# EAGLE design SC_customized2 (EAGLE 9.5.2)
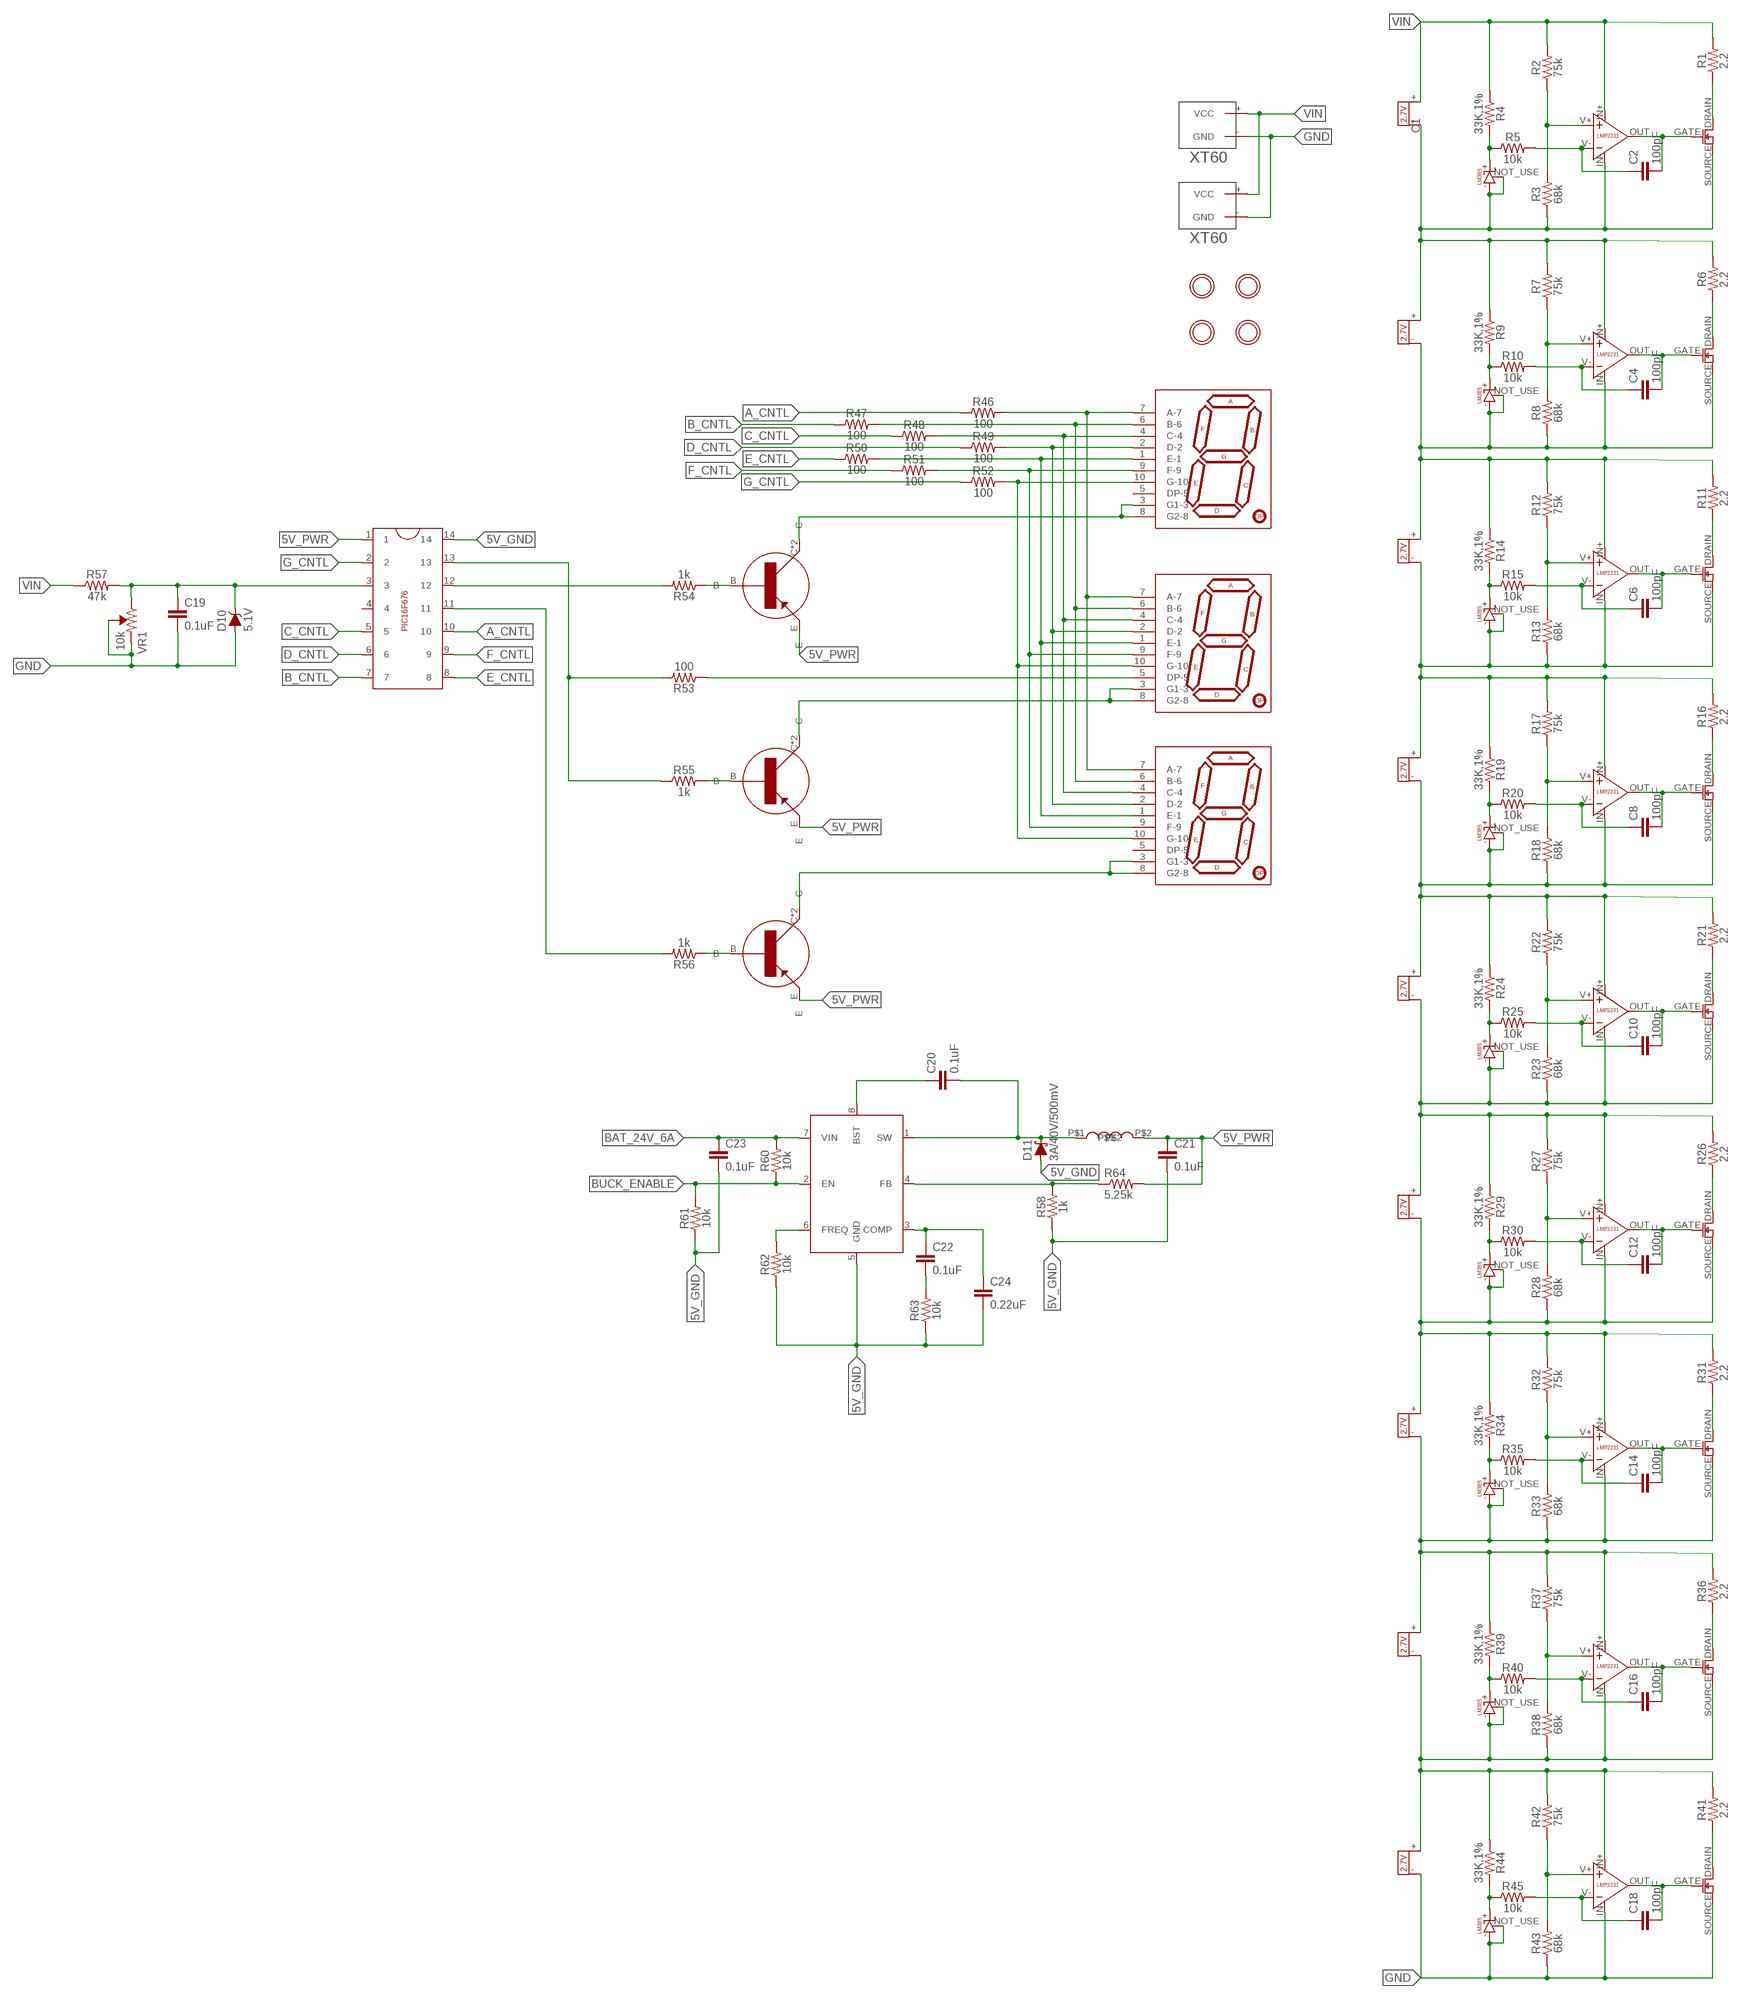
[diagram p0: schematic, sheet 1]

## Parts
3.3V_BUCK  SOIC8E  [SOIC127P600X170-9N]
C1  2.7V 60F  2.7V_60F  [2.7V_60F]
C2  100pF  100PF-0603-50V-5%  [0603]
C3  2.7V 60F  2.7V_60F  [2.7V_60F]
C4  100pF  100PF-0603-50V-5%  [0603]
C5  2.7V 60F  2.7V_60F  [2.7V_60F]
C6  100pF  100PF-0603-50V-5%  [0603]
C7  2.7V 60F  2.7V_60F  [2.7V_60F]
C8  100pF  100PF-0603-50V-5%  [0603]
C9  2.7V 60F  2.7V_60F  [2.7V_60F]
C10  100pF  100PF-0603-50V-5%  [0603]
C11  2.7V 60F  2.7V_60F  [2.7V_60F]
C12  100pF  100PF-0603-50V-5%  [0603]
C13  2.7V 60F  2.7V_60F  [2.7V_60F]
C14  100pF  100PF-0603-50V-5%  [0603]
C15  2.7V 60F  2.7V_60F  [2.7V_60F]
C16  100pF  100PF-0603-50V-5%  [0603]
C17  2.7V 60F  2.7V_60F  [2.7V_60F]
C18  100pF  100PF-0603-50V-5%  [0603]
C19  0.1uF  0.1UF-0603-25V-5%  [0603]
C20  0.1uF  0.1UF-0603-25V-(+80/-20%)  [0603]
C21  0.1uF  0.1UF-0603-25V-(+80/-20%)  [0603]
C22  0.1uF  0.1UF-0603-25V-(+80/-20%)  [0603]
C23  0.1uF  0.1UF-0603-25V-(+80/-20%)  [0603]
C24  0.22uF  0.22UF-0603-50V-(-20/+80%)  [0603]
D1  LM385  [LM385_SOT23]
D2  LM385  [LM385_SOT23]
D3  LM385  [LM385_SOT23]
D4  LM385  [LM385_SOT23]
D5  LM385  [LM385_SOT23]
D6  LM385  [LM385_SOT23]
D7  LM385  [LM385_SOT23]
D8  LM385  [LM385_SOT23]
D9  LM385  [LM385_SOT23]
D10  5.1V  DIODE-ZENER-MMSZ5232BS  [SOD-323]
D11  3A/40V/500mV  DIODE-SCHOTTKY-B340A  [SMA-DIODE]
LMP1  LMP2231  [LMP2231_SOT23_5]
LMP2  LMP2231  [LMP2231_SOT23_5]
LMP3  LMP2231  [LMP2231_SOT23_5]
LMP4  LMP2231  [LMP2231_SOT23_5]
LMP5  LMP2231  [LMP2231_SOT23_5]
LMP6  LMP2231  [LMP2231_SOT23_5]
LMP7  LMP2231  [LMP2231_SOT23_5]
LMP8  LMP2231  [LMP2231_SOT23_5]
LMP9  LMP2231  [LMP2231_SOT23_5]
MOS1  IRLML2502TRPBF_MOS  [IRLML2502TRPBF_SOT23]
MOS2  IRLML2502TRPBF_MOS  [IRLML2502TRPBF_SOT23]
MOS3  IRLML2502TRPBF_MOS  [IRLML2502TRPBF_SOT23]
MOS4  IRLML2502TRPBF_MOS  [IRLML2502TRPBF_SOT23]
MOS5  IRLML2502TRPBF_MOS  [IRLML2502TRPBF_SOT23]
MOS6  IRLML2502TRPBF_MOS  [IRLML2502TRPBF_SOT23]
MOS7  IRLML2502TRPBF_MOS  [IRLML2502TRPBF_SOT23]
MOS8  IRLML2502TRPBF_MOS  [IRLML2502TRPBF_SOT23]
MOS9  IRLML2502TRPBF_MOS  [IRLML2502TRPBF_SOT23]
PWR_IN  XT60  [XT60]
PWR_OUT  XT60  [XT60]
R1  2.2  0.05OHM-2512-3W-1%  [2512]
R2  75k  75KOHM-0603-1/10W-1%  [0603@1]
R3  68k  75KOHM-0603-1/10W-1%  [0603@1]
R4  33K,1%  1MOHM-0603-1/4W-5%  [0603@1]
R5  10k  10KOHM-0603-1/10W-1%  [0603]
R6  2.2  0.05OHM-2512-3W-1%  [2512]
R7  75k  75KOHM-0603-1/10W-1%  [0603@1]
R8  68k  75KOHM-0603-1/10W-1%  [0603@1]
R9  33K,1%  1MOHM-0603-1/4W-5%  [0603@1]
R10  10k  10KOHM-0603-1/10W-1%  [0603]
R11  2.2  0.05OHM-2512-3W-1%  [2512]
R12  75k  75KOHM-0603-1/10W-1%  [0603@1]
R13  68k  75KOHM-0603-1/10W-1%  [0603@1]
R14  33K,1%  1MOHM-0603-1/4W-5%  [0603@1]
R15  10k  10KOHM-0603-1/10W-1%  [0603]
R16  2.2  0.05OHM-2512-3W-1%  [2512]
R17  75k  75KOHM-0603-1/10W-1%  [0603@1]
R18  68k  75KOHM-0603-1/10W-1%  [0603@1]
R19  33K,1%  1MOHM-0603-1/4W-5%  [0603@1]
R20  10k  10KOHM-0603-1/10W-1%  [0603]
R21  2.2  0.05OHM-2512-3W-1%  [2512]
R22  75k  75KOHM-0603-1/10W-1%  [0603@1]
R23  68k  75KOHM-0603-1/10W-1%  [0603@1]
R24  33K,1%  1MOHM-0603-1/4W-5%  [0603@1]
R25  10k  10KOHM-0603-1/10W-1%  [0603]
R26  2.2  0.05OHM-2512-3W-1%  [2512]
R27  75k  75KOHM-0603-1/10W-1%  [0603@1]
R28  68k  75KOHM-0603-1/10W-1%  [0603@1]
R29  33K,1%  1MOHM-0603-1/4W-5%  [0603@1]
R30  10k  10KOHM-0603-1/10W-1%  [0603]
R31  2.2  0.05OHM-2512-3W-1%  [2512]
R32  75k  75KOHM-0603-1/10W-1%  [0603@1]
R33  68k  75KOHM-0603-1/10W-1%  [0603@1]
R34  33K,1%  1MOHM-0603-1/4W-5%  [0603@1]
R35  10k  10KOHM-0603-1/10W-1%  [0603]
R36  2.2  0.05OHM-2512-3W-1%  [2512]
R37  75k  75KOHM-0603-1/10W-1%  [0603@1]
R38  68k  75KOHM-0603-1/10W-1%  [0603@1]
R39  33K,1%  1MOHM-0603-1/4W-5%  [0603@1]
R40  10k  10KOHM-0603-1/10W-1%  [0603]
R41  2.2  0.05OHM-2512-3W-1%  [2512]
R42  75k  75KOHM-0603-1/10W-1%  [0603@1]
R43  68k  75KOHM-0603-1/10W-1%  [0603@1]
R44  33K,1%  1MOHM-0603-1/4W-5%  [0603@1]
R45  10k  10KOHM-0603-1/10W-1%  [0603]
R46  100  100OHM-0603-1/4W-5%  [0603]
R47  100  100OHM-0603-1/4W-5%  [0603]
R48  100  100OHM-0603-1/4W-5%  [0603]
R49  100  100OHM-0603-1/4W-5%  [0603]
R50  100  100OHM-0603-1/4W-5%  [0603]
R51  100  100OHM-0603-1/4W-5%  [0603]
R52  100  100OHM-0603-1/4W-5%  [0603]
R53  100  100OHM-0603-1/4W-5%  [0603]
R54  1k  1KOHM-0603-1/10W-1%  [0603]
R55  1k  1KOHM-0603-1/10W-1%  [0603]
R56  1k  1KOHM-0603-1/10W-1%  [0603]
R57  47k  47KOHM-0603-1/10W-1%  [0603]
R58  1k  1KOHM-0603-1/10W-1%  [0603]
R60  10k  10KOHM-0603-1/10W-1%  [0603]
R61  10k  10KOHM-0603-1/10W-1%  [0603]
R62  10k  10KOHM-0603-1/10W-1%  [0603]
R63  10k  10KOHM-0603-1/10W-1%  [0603]
R64  5.25k  CRCW08050000Z0EA  [RES_0805]
U$1  MOUNTINGHOLE2.5  [MOUNTINGHOLE_2.5_PLATED]
U$2  MOUNTINGHOLE2.5  [MOUNTINGHOLE_2.5_PLATED]
U$3  PZT3906  [SOT_223]
U$4  MOUNTINGHOLE2.5  [MOUNTINGHOLE_2.5_PLATED]
U$5  PZT3906  [SOT_223]
U$6  PZT3906  [SOT_223]
U$7  DSM7T  [7-SEGMENT_SMD]
U$8  DSM7T  [7-SEGMENT_SMD]
U$9  DSM7T  [7-SEGMENT_SMD]
U$10  PIC16F676  [PIC16F676]
U$11  4.7UH_INDUCTOR  [4.7UH_INDUCTOR]
U$49  MOUNTINGHOLE2.5  [MOUNTINGHOLE_2.5_PLATED]
VR1  10k  TRIMPOT-SMD-3MM-OPEN-1/10W-25%  [TRIMPOT-SMD-TC33X]

## Nets
5V_GND: 3.3V_BUCK.5(GND) C21.2 C23.2 C24.2 D11.A R58.1 R61.1 R62.1 R63.1 U$10.14
5V_PWR: C21.1 R64.2 U$3.E U$5.E U$6.E U$10.1 U$11.P$2
A_CNTL: R46.1 U$10.10
B_CNTL: R47.1 U$10.7
BAT_24V_6A: 3.3V_BUCK.7(VIN) C23.1 R60.2
BUCK_ENABLE: 3.3V_BUCK.2(EN) R60.1 R61.2
C_CNTL: R48.1 U$10.5
D_CNTL: R49.1 U$10.6
E_CNTL: R50.1 U$10.8
F_CNTL: R51.1 U$10.9
G_CNTL: R52.1 U$10.2
GND: C17.- C19.2 D9.- D9.NOT_USE D10.A LMP9.IN- MOS9.SOURCE PWR_IN.-(GND) PWR_OUT.-(GND) R43.1 VR1.2(WIPER) VR1.3(CCW)
N$1: R46.2 U$7.7(A-7) U$8.7(A-7) U$9.7(A-7)
N$2: MOS1.DRAIN R1.P$1
N$3: C2.2 LMP1.OUT MOS1.GATE
N$4: C1.- C3.+ D1.- D1.NOT_USE LMP1.IN- LMP2.IN+ MOS1.SOURCE R3.1 R6.P$2 R7.2 R9.1
N$5: LMP1.V+ R2.1 R3.2
N$6: C2.1 LMP1.V- R5.2
N$7: D1.+ R4.2 R5.1
N$8: C19.1 D10.C R57.2 U$10.3 VR1.1(CW)
N$9: MOS2.DRAIN R6.P$1
N$10: C4.2 LMP2.OUT MOS2.GATE
N$11: C3.- C5.+ D2.- D2.NOT_USE LMP2.IN- LMP3.IN+ MOS2.SOURCE R8.1 R11.P$2 R12.2 R14.1
N$12: LMP2.V+ R7.1 R8.2
N$13: C4.1 LMP2.V- R10.2
N$14: D2.+ R9.2 R10.1
N$15: R47.2 U$7.6(B-6) U$8.6(B-6) U$9.6(B-6)
N$16: MOS3.DRAIN R11.P$1
N$17: C6.2 LMP3.OUT MOS3.GATE
N$18: C5.- C7.+ D3.- D3.NOT_USE LMP3.IN- LMP4.IN+ MOS3.SOURCE R13.1 R16.P$2 R17.2 R19.1
N$19: LMP3.V+ R12.1 R13.2
N$20: C6.1 LMP3.V- R15.2
N$21: D3.+ R14.2 R15.1
N$22: R56.2 U$10.11
N$23: MOS4.DRAIN R16.P$1
N$24: C8.2 LMP4.OUT MOS4.GATE
N$25: C7.- C9.+ D4.- D4.NOT_USE LMP4.IN- LMP5.IN+ MOS4.SOURCE R18.1 R21.P$2 R22.2 R24.1
N$26: LMP4.V+ R17.1 R18.2
N$27: C8.1 LMP4.V- R20.2
N$28: D4.+ R19.2 R20.1
N$29: R48.2 U$7.4(C-4) U$8.4(C-4) U$9.4(C-4)
N$30: MOS5.DRAIN R21.P$1
N$31: C10.2 LMP5.OUT MOS5.GATE
N$32: C9.- C11.+ D5.- D5.NOT_USE LMP5.IN- LMP6.IN+ MOS5.SOURCE R23.1 R26.P$2 R27.2 R29.1
N$33: LMP5.V+ R22.1 R23.2
N$34: C10.1 LMP5.V- R25.2
N$35: D5.+ R24.2 R25.1
N$36: R49.2 U$7.2(D-2) U$8.2(D-2) U$9.2(D-2)
N$37: MOS6.DRAIN R26.P$1
N$38: C12.2 LMP6.OUT MOS6.GATE
N$39: C11.- C13.+ D6.- D6.NOT_USE LMP6.IN- LMP7.IN+ MOS6.SOURCE R28.1 R31.P$2 R32.2 R34.1
N$40: LMP6.V+ R27.1 R28.2
N$41: C12.1 LMP6.V- R30.2
N$42: D6.+ R29.2 R30.1
N$43: R50.2 U$7.1(E-1) U$8.1(E-1) U$9.1(E-1)
N$44: MOS7.DRAIN R31.P$1
N$45: C14.2 LMP7.OUT MOS7.GATE
N$46: C13.- C15.+ D7.- D7.NOT_USE LMP7.IN- LMP8.IN+ MOS7.SOURCE R33.1 R36.P$2 R37.2 R39.1
N$47: LMP7.V+ R32.1 R33.2
N$48: C14.1 LMP7.V- R35.2
N$49: D7.+ R34.2 R35.1
N$50: R56.1 U$6.B
N$51: MOS8.DRAIN R36.P$1
N$52: C16.2 LMP8.OUT MOS8.GATE
N$53: C15.- C17.+ D8.- D8.NOT_USE LMP8.IN- LMP9.IN+ MOS8.SOURCE R38.1 R41.P$2 R42.2 R44.1
N$54: LMP8.V+ R37.1 R38.2
N$55: C16.1 LMP8.V- R40.2
N$56: D8.+ R39.2 R40.1
N$57: U$3.C U$3.C2(C) U$7.3(G1-3) U$7.8(G2-8)
N$58: MOS9.DRAIN R41.P$1
N$59: C18.2 LMP9.OUT MOS9.GATE
N$60: U$5.C U$5.C2(C) U$9.3(G1-3) U$9.8(G2-8)
N$61: LMP9.V+ R42.1 R43.2
N$62: C18.1 LMP9.V- R45.2
N$63: D9.+ R44.2 R45.1
N$64: U$6.C U$6.C2(C) U$8.3(G1-3) U$8.8(G2-8)
N$65: R55.2 U$5.B
N$66: R54.1 U$3.B
N$67: R53.1 U$9.5(DP-5)
N$68: R53.2 R55.1 U$10.13
N$69: R54.2 U$10.12
N$70: R51.2 U$7.9(F-9) U$8.9(F-9) U$9.9(F-9)
N$71: R52.2 U$7.10(G-10) U$8.10(G-10) U$9.10(G-10)
N$72: 3.3V_BUCK.1(SW) C20.2 D11.C U$11.P$1
N$73: 3.3V_BUCK.4(FB) R58.2 R64.1
N$74: 3.3V_BUCK.8(BST) C20.1
N$75: 3.3V_BUCK.6(FREQ) R62.2
N$76: 3.3V_BUCK.3(COMP) C22.1 C24.1
N$77: C22.2 R63.2
VIN: C1.+ LMP1.IN+ PWR_IN.+(VCC) PWR_OUT.+(VCC) R1.P$2 R2.2 R4.1 R57.1
Unconnected: U$7.5(DP-5) U$8.5(DP-5) U$10.4

## Library data of the parts
3.3V_BUCK = SOIC127P600X170-9N:SOIC8E
C1 C3 C5 C7 C9 C11 C13 C15 C17 = personal Made:2.7V_60F
C2 C4 C6 C8 C10 C12 C14 C16 C18 = SparkFun-Capacitors:100PF: 100pF/0.1nF ceramic capacitors A capacitor is a passive two-terminal electrical component used to store electrical energy temporarily in an electric field.; PROD_ID: CAP-07883
C19 = SparkFun-Capacitors:0.1UF: 0.1µF ceramic capacitors A capacitor is a passive two-terminal electrical component used to store electrical energy temporarily in an electric field.; PROD_ID: CAP-08604
C20-C23 = SparkFun-Capacitors:0.1UF: 0.1µF ceramic capacitors A capacitor is a passive two-terminal electrical component used to store electrical energy temporarily in an electric field.; PROD_ID: CAP-00810
C24 = SparkFun-Capacitors:0.22UF: 0.22µF ceramic capacitors A capacitor is a passive two-terminal electrical component used to store electrical energy temporarily in an electric field.; PROD_ID: CAP-09885
D1-D9 = personal Made:LM385
D10 = SparkFun-DiscreteSemi:DIODE-ZENER: Zener Diode A Zener diode allows current to flow from its anode to its cathode like a normal semiconductor diode, but it also permits current to flow in the reverse direction when its "Zener voltage" is reached. - WIkipedia; PROD_ID: DIO-12442; VALUE: 5.6V
D11 = SparkFun-DiscreteSemi:DIODE-SCHOTTKY: Schottky diode A Schottky diode is a semiconductor diode which has a low forward voltage drop and a very fast switching action.; PROD_ID: DIO-09886
LMP1-LMP9 = personal Made:LMP2231
MOS1-MOS9 = personal Made:IRLML2502TRPBF_MOS
PWR_IN PWR_OUT = XT60:XT60: XT60
R1 R6 R11 R16 R21 R26 R31 R36 R41 = SparkFun-Resistors:0.05OHM: 0.05Ω resistor A resistor is a passive two-terminal electrical component that implements electrical resistance as a circuit element. Resistors act to reduce current flow, and, at the same time, act to lower voltage levels within circuits. - Wikipedia; PROD_ID: RES-13771; VALUE: 0.05
R2 R3 R7 R8 R12 R13 R17 R18 R22 R23 R27 R28 R32 R33 R37 R38 R42 R43 = SparkFun-Resistors:75KOHM: 75Ω resistor A resistor is a passive two-terminal electrical component that implements electrical resistance as a circuit element. Resistors act to reduce current flow, and, at the same time, act to lower voltage levels within circuits. - Wikipedia; PROD_ID: RES-09737; VALUE: 75
R4 R9 R14 R19 R24 R29 R34 R39 R44 = SparkFun-Resistors:1MOHM: 1MΩ resistor A resistor is a passive two-terminal electrical component that implements electrical resistance as a circuit element. Resistors act to reduce current flow, and, at the same time, act to lower voltage levels within circuits. - Wikipedia; PROD_ID: RES-07868; VALUE: 1M
R5 R10 R15 R20 R25 R30 R35 R40 R45 R60-R63 = SparkFun-Resistors:10KOHM: 10kΩ resistor A resistor is a passive two-terminal electrical component that implements electrical resistance as a circuit element. Resistors act to reduce current flow, and, at the same time, act to lower voltage levels within circuits. - Wikipedia; PROD_ID: RES-00824
R46-R53 = SparkFun-Resistors:100OHM: 100Ω resistor A resistor is a passive two-terminal electrical component that implements electrical resistance as a circuit element. Resistors act to reduce current flow, and, at the same time, act to lower voltage levels within circuits. - Wikipedia; PROD_ID: RES-12438
R54-R56 R58 = SparkFun-Resistors:1KOHM: 1kΩ resistor A resistor is a passive two-terminal electrical component that implements electrical resistance as a circuit element. Resistors act to reduce current flow, and, at the same time, act to lower voltage levels within circuits. - Wikipedia; PROD_ID: RES-07856
R57 = SparkFun-Resistors:47KOHM: 47kΩ resistor A resistor is a passive two-terminal electrical component that implements electrical resistance as a circuit element. Resistors act to reduce current flow, and, at the same time, act to lower voltage levels within circuits. - Wikipedia; PROD_ID: RES-07871
R64 = Resistor_Capacitor:CRCW08050000Z0EA: RES SMD 0 OHM JUMPER 1/8W 0805 Manufacturer's datasheet <http://www.vishay.com/docs/20035/dcrcwe3.pdf>; CREATED_BY: PCBLayout.com; DIGIKEY_PART_NUMBER: 541-0.0ATR-ND; MANUFACTURER: Vishay Dale; MPN: CRCW08050000Z0EA; PACKAGE: SMD 0805
U$1 U$2 U$4 U$49 = microbuilder:MOUNTINGHOLE: Mounting Hole For #2 screws (0.086"/2.18mm width, 0.094"/2.4mm hole) use 2.5mm; BOM: EXCLUDE
U$3 U$5 U$6 = Custom:PZT3906
U$7-U$9 = Custom:DSM7T
U$10 = Custom:PIC16F676
U$11 = Custom:4.7UH_INDUCTOR
VR1 = SparkFun-Resistors:TRIMPOT: Trimming Potentiometer (Trimpot) Three-terminal potentiometers, with an adjustable wiper and two adjustable resistors. A pot can be used to create a configurable voltage divider, or as a variable resistor. "Trimpots" are a subset of potentiometers, usually intended for "set-and-forget" applications. They're often more delicate than standard potentiometers - rated for fewer turns. Variants PTH-KNOB - PTH Trimpot w/ finger-adjustable knob Trimpot 10K with Knob <https://www.sparkfun.com/products/9806> (COM-09806) Datasheet <http://www.sparkfun.com/datasheets/Components/General/TSR-3386.pdf> SMD-3MM-CLOSED-FRAME - SMD 3mm Square Closed-Frame Trimpot Used on e.g. EasyDriver - Stepper Motor Driver <https://www.sparkfun.com/products/12779> Datasheet <http://www.bitechnologies.com/pdfs/22.pdf> (22AR10KTR) SMD-5MM - SMD 5mm Square Closed-Frame Trimpot Used on e.g. IOIO-OTG - V2.2 <https://www.sparkfun.com/products/13613> Datasheet <http://www.vishay.com/docs/51008/ts53.pdf> (TS53YL502MR10) SMD-3MM-1/10W-25% - 3mm Square Open-Frame Trimpot Used on e.g. SparkFun Shapeoko <https://www.sparkfun.com/products/13899> Datasheet <http://www.bourns.com/docs/Product-Datasheets/TC33.pdf> (TC33X-2-103E); PROD_ID: RES-12428

## Board
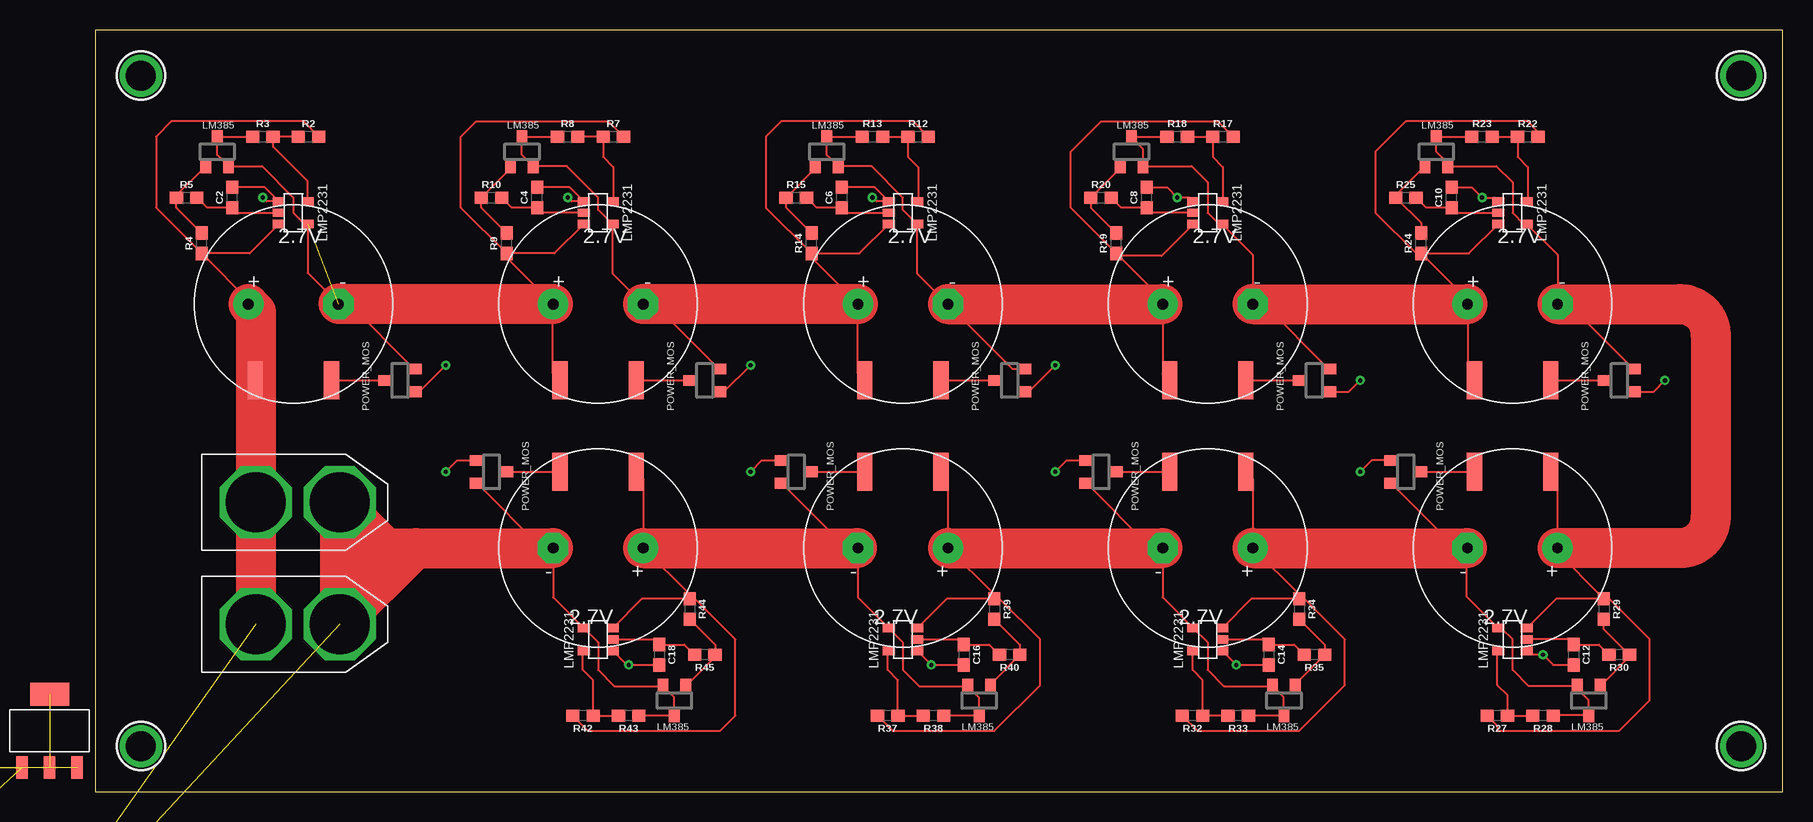
[diagram p1: board, top side]
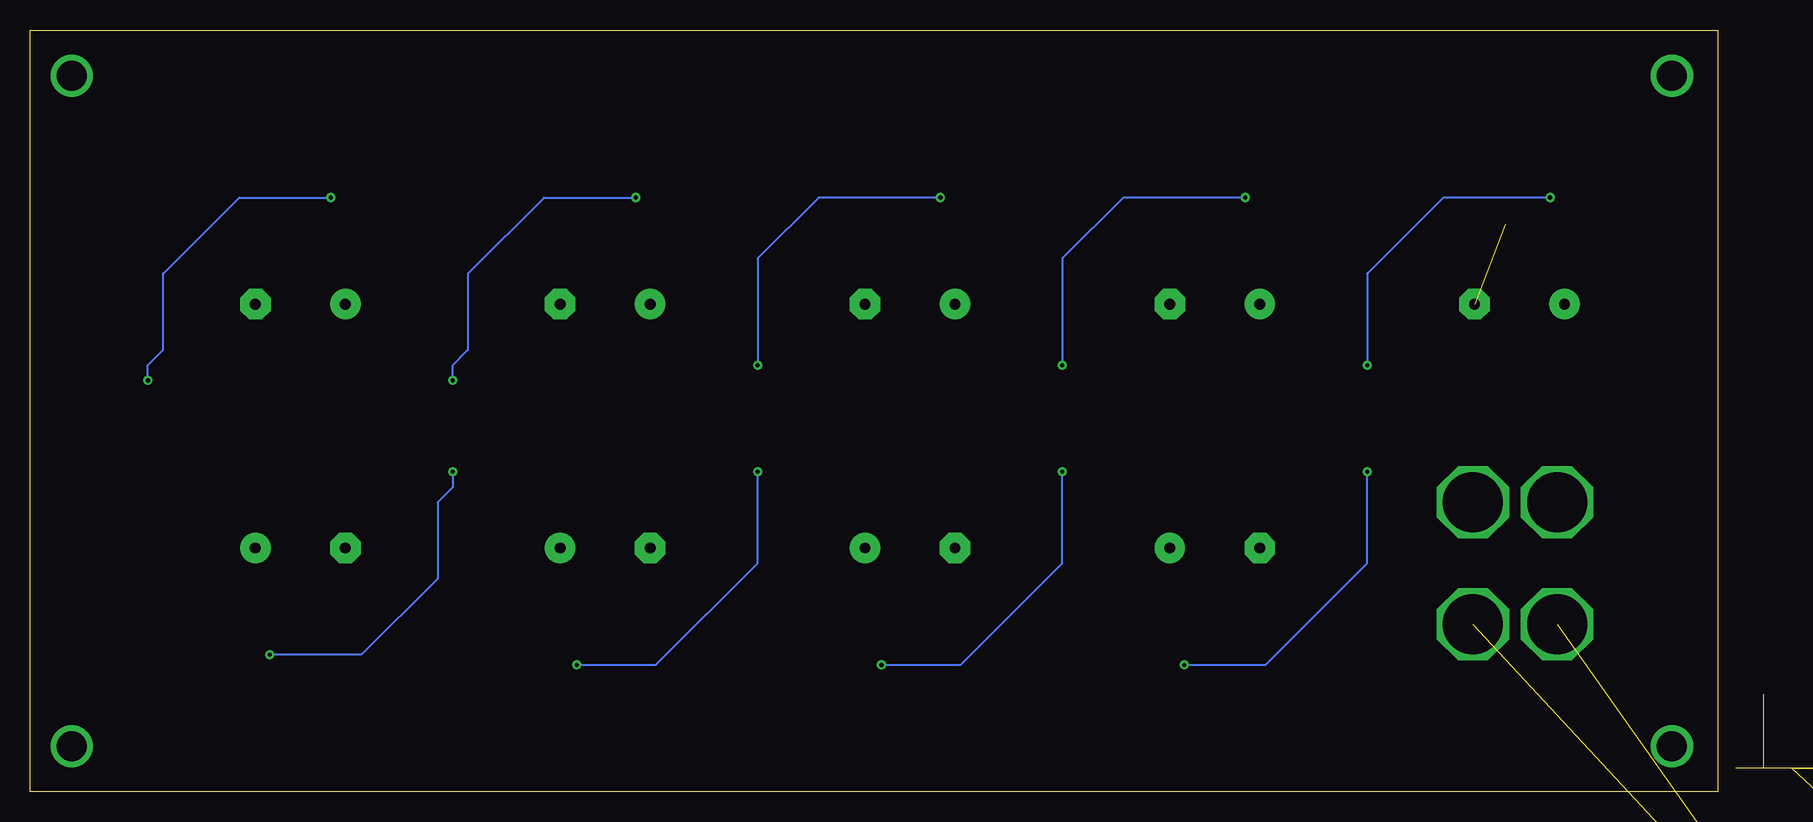
[diagram p2: board, bottom side, seen from below]

Size 140.64 x 63.49 mm. Coordinates in mm from the lower left corner, seen from the top.
Outline: 0,63.49 0,0 140.64,0 140.64,63.49 0,63.49
Copper layers (1*16): Top 0.035mm / dielectric 1.5mm / Bottom 0.035mm
Design rules "default": minimum track width 6mil, minimum drill 0.35mm, track to track 6mil, track to pad 6mil, pad to pad 6mil, via to via 6mil, smd to smd 6mil, copper to edge 40mil, drill to drill 6mil, minimum pad ring 10mil, minimum via ring 8mil, stop-mask expansion 4mil, vias tented up to drill 0mil, thermal gap 10mil

### Footprints (pad centres in the part's own frame; a part is rotated, then mirrored left to right if it is on the bottom)
SOIC127P600X170-9N = smd 1.97 x 0.6: 1 -2.475,1.905; 2 -2.475,0.635; 3 -2.475,-0.635; 4 -2.475,-1.905; 5 2.475,-1.905; 6 2.475,-0.635; 7 2.475,0.635; 8 2.475,1.905 | smd 2.4 x 3.1: 9 0,0 | drill 0.3 pad 0.4: V1 -0.65,1.3; V2 0.65,1.3; V3 -0.65,0; V4 0.65,0; V5 -0.65,-1.3; V6 0.65,-1.3
2.7V_60F = drill 0.9 pad 2.54: + -3.75,0 | drill 0.9 pad 2.54 octagon: - 3.75,0
0603 = smd 1.1 x 1: 1 -0.85,0; 2 0.85,0
LM385_SOT23 = smd 0.9 x 1.2: + -0.95,-1.2; - 0.95,-1.2; NOT_USE 0,1.2
SOD-323 = smd 0.63 x 0.83: A 1.15,0; C -1.15,0
SMA-DIODE = smd 1.27 x 1.47: A -2.15,0; C 2.15,0
LMP2231_SOT23_5 = smd 0.7 x 1: IN+ 0.95,-1.2; IN- 0.95,1.2; OUT -0.95,-1.2; V+ -0.95,1.2; V- 0,-1.2
IRLML2502TRPBF_SOT23 = smd 0.9 x 1.2: DRAIN 0,1.2; GATE -0.95,-1.2; SOURCE 0.95,-1.2
XT60 = drill 5 octagon: + 4.5,0; - 11.5,0
2512 = smd 1.27 x 3.175: P$1 -3.175,0; P$2 3.175,0
0603@1 = smd 1.1 x 1: 1 -0.85,0; 2 0.85,0
RES_0805 = smd 0.87 x 1.42: 1 -0.975,0; 2 0.975,0
MOUNTINGHOLE_2.5_PLATED = drill 2.5 pad 3.2: P$1 0,0
SOT_223 = smd 0.95 x 1.9: B -2.3,-3.05; C 0,-3.05; E 2.3,-3.05 | smd 3.25 x 1.9: C2 0,3.05
7-SEGMENT_SMD = smd 1 x 2: 1 -3,-6; 2 -1.5,-6; 3 0,-6; 4 1.5,-6; 5 3,-6; 6 3,6; 7 1.5,6; 8 0,6; 9 -1.5,6; 10 -3,6
PIC16F676 = smd 0.6 x 1.5: 1 -3.81,-2.7; 2 -2.54,-2.7; 3 -1.27,-2.7; 4 0,-2.7; 5 1.27,-2.7; 6 2.54,-2.7; 7 3.81,-2.7; 8 3.81,2.7; 9 2.54,2.7; 10 1.27,2.7; 11 0,2.7; 12 -1.27,2.7; 13 -2.54,2.7; 14 -3.81,2.7
4.7UH_INDUCTOR = smd 2.4 x 5.1: P$1 -2.35,0; P$2 2.35,0
TRIMPOT-SMD-TC33X = smd 1.2 x 1.2: 1 -1,-1.825; 3 1,-1.825 | smd 1.5 x 1.6: 2 0,1.5

### Placement (x,y rotation side)
3.3V_BUCK  -40.64,-73.66 0 top  (outside the outline)
C1  16.51,40.64 0 top
C2  11.43,49.53 90 top
C3  41.91,40.64 0 top
C4  36.83,49.53 90 top
C5  67.31,40.64 0 top
C6  62.23,49.53 90 top
C7  92.71,40.64 0 top
C8  87.63,49.53 90 top
C9  118.11,40.64 0 top
C10  113.03,49.53 90 top
C11  118.11,20.32 180 top
C12  123.19,11.43 270 top
C13  92.71,20.32 180 top
C14  97.79,11.43 270 top
C15  67.31,20.32 180 top
C16  72.39,11.43 270 top
C17  41.91,20.32 180 top
C18  46.99,11.43 270 top
C19  -43.18,-57.15 0 top  (outside the outline)
C20  -36.83,-80.01 0 top  (outside the outline)
C21  -33.02,-80.01 0 top  (outside the outline)
C22  -29.21,-80.01 0 top  (outside the outline)
C23  -43.18,-86.36 0 top  (outside the outline)
C24  -39.37,-86.36 0 top  (outside the outline)
D1  10.16,53.34 0 top
D2  35.56,53.34 0 top
D3  60.96,53.34 0 top
D4  86.36,53.34 0 top
D5  111.76,53.34 0 top
D6  124.46,7.62 180 top
D7  99.06,7.62 180 top
D8  73.66,7.62 180 top
D9  48.26,7.62 180 top
D10  -43.18,-53.34 0 top  (outside the outline)
D11  -41.91,-81.28 0 top  (outside the outline)
LMP1  16.51,48.26 270 top
LMP2  41.91,48.26 270 top
LMP3  67.31,48.26 270 top
LMP4  92.71,48.26 270 top
LMP5  118.11,48.26 270 top
LMP6  118.11,12.7 90 top
LMP7  92.71,12.7 90 top
LMP8  67.31,12.7 90 top
LMP9  41.91,12.7 90 top
MOS1  25.4,34.29 90 top
MOS2  50.8,34.29 90 top
MOS3  76.2,34.29 90 top
MOS4  101.6,34.29 90 top
MOS5  127,34.29 90 top
MOS6  109.22,26.67 270 top
MOS7  83.82,26.67 270 top
MOS8  58.42,26.67 270 top
MOS9  33.02,26.67 270 top
PWR_IN  8.89,24.13 0 top
PWR_OUT  8.89,13.97 0 top
R1  16.51,34.29 180 top
R2  17.78,54.61 0 top
R3  13.97,54.61 0 top
R4  8.89,45.72 90 top
R5  7.62,49.53 0 top
R6  41.91,34.29 180 top
R7  43.18,54.61 0 top
R8  39.37,54.61 0 top
R9  34.29,45.72 90 top
R10  33.02,49.53 0 top
R11  67.31,34.29 180 top
R12  68.58,54.61 0 top
R13  64.77,54.61 0 top
R14  59.69,45.72 90 top
R15  58.42,49.53 0 top
R16  92.71,34.29 180 top
R17  93.98,54.61 0 top
R18  90.17,54.61 0 top
R19  85.09,45.72 90 top
R20  83.82,49.53 0 top
R21  118.11,34.29 180 top
R22  119.38,54.61 0 top
R23  115.57,54.61 0 top
R24  110.49,45.72 90 top
R25  109.22,49.53 0 top
R26  118.11,26.67 0 top
R27  116.84,6.35 180 top
R28  120.65,6.35 180 top
R29  125.73,15.24 270 top
R30  127,11.43 180 top
R31  92.71,26.67 0 top
R32  91.44,6.35 180 top
R33  95.25,6.35 180 top
R34  100.33,15.24 270 top
R35  101.6,11.43 180 top
R36  67.31,26.67 0 top
R37  66.04,6.35 180 top
R38  69.85,6.35 180 top
R39  74.93,15.24 270 top
R40  76.2,11.43 180 top
R41  41.91,26.67 0 top
R42  40.64,6.35 180 top
R43  44.45,6.35 180 top
R44  49.53,15.24 270 top
R45  50.8,11.43 180 top
R46  -43.18,-2.54 0 top  (outside the outline)
R47  -43.18,-6.35 0 top  (outside the outline)
R48  -43.18,-10.16 0 top  (outside the outline)
R49  -43.18,-13.97 0 top  (outside the outline)
R50  -43.18,-17.78 0 top  (outside the outline)
R51  -43.18,-21.59 0 top  (outside the outline)
R52  -43.18,-25.4 0 top  (outside the outline)
R53  -43.18,-29.21 0 top  (outside the outline)
R54  -43.18,-33.02 0 top  (outside the outline)
R55  -43.18,-36.83 0 top  (outside the outline)
R56  -43.18,-40.64 0 top  (outside the outline)
R57  -43.18,-67.31 0 top  (outside the outline)
R58  -35.56,-86.36 0 top  (outside the outline)
R60  -27.94,-86.36 0 top  (outside the outline)
R61  -43.18,-90.17 0 top  (outside the outline)
R62  -39.37,-90.17 0 top  (outside the outline)
R63  -35.56,-90.17 0 top  (outside the outline)
R64  -41.91,-95.25 0 top  (outside the outline)
U$1  137.16,59.69 0 top
U$2  137.16,3.81 0 top
U$3  -3.81,5.08 0 top
U$4  3.81,59.69 0 top
U$5  -11.43,5.08 0 top  (outside the outline)
U$6  -19.05,5.08 0 top  (outside the outline)
U$7  -26.67,7.62 0 top  (outside the outline)
U$8  -34.29,7.62 0 top  (outside the outline)
U$9  -41.91,7.62 0 top  (outside the outline)
U$10  -40.64,-46.99 0 top  (outside the outline)
U$11  -30.48,-72.39 0 top  (outside the outline)
U$49  3.81,3.81 0 top
VR1  -41.91,-62.23 0 top  (outside the outline)

### Tracks (layer width: path | path; a pad name or v marks a point on that pad's centre or on a via)
5V_GND  (9 unrouted)
5V_PWR  (6 unrouted)
A_CNTL  (1 unrouted)
B_CNTL  (1 unrouted)
BAT_24V_6A  (2 unrouted)
BUCK_ENABLE  (2 unrouted)
C_CNTL  (1 unrouted)
D_CNTL  (1 unrouted)
E_CNTL  (1 unrouted)
F_CNTL  (1 unrouted)
G_CNTL  (1 unrouted)
GND  (4 unrouted)
  Top 0.152: MOS9.SOURCE 37.22,20.32 C17.- 38.16,16.2 LMP9.IN- 41.91,12.45 41.91,10.16 43.25,8.82 D9.- 48.19,7.94 48.19,6.35 | D9.NOT_USE 48.19,6.35 | 48.19,6.35 R43.1
  Top 3.353: 20.39,19.05 PWR_IN.- 24.2,20.32 26.74,20.32 | 20.39,19.05 PWR_OUT.- 26.74,20.32 | 26.74,20.32 C17.- | 20.39,19.05 21.59,19.05
N$1  (3 unrouted)
N$2
  Top 0.152: R1.P$1 MOS1.DRAIN
N$3  (via drill 0.35)
  Top 0.152: C2.2 14.14,50.38 LMP1.OUT 14.29,49.21 v13.97,49.53 | v29.21,35.56 26.99,33.34 MOS1.GATE
  Bottom 0.152: v13.97,49.53 22.86,49.53 29.21,43.18 v29.21,35.56
N$4  (1 unrouted)
  Top 0.152: MOS1.SOURCE 21.14,40.7 20.26,40.7 17.71,43.25 LMP1.IN- 17.46,47.31 16.51,48.26 16.51,49.53 13.9,52.14 D1.- 10.16,53.09 D1.NOT_USE 13.05,54.54 R3.1 | LMP2.IN+ 38.27,44.87 R9.1 | C3.+ 38.13,40.67 | 38.13,40.67 34.29,44.51 R9.1 | R6.P$2 38.13,34.9 38.13,40.67 | R9.1 30.48,48.68 30.48,54.61 31.75,55.88 42.76,55.88 R7.2
  Top 3.353: C3.+ 20.32,40.64 20.26,40.7
N$5
  Top 0.152: LMP1.V+ 17.71,50.87 14.82,53.76 R3.2 R2.1
N$6
  Top 0.152: LMP1.V- 11.85,48.26 C2.1 9.32,48.68 R5.2
N$7
  Top 0.152: R4.2 6.77,48.69 R5.1 6.77,49.7 D1.+
N$8  (4 unrouted)
N$9
  Top 0.152: R6.P$1 MOS2.DRAIN
N$10  (via drill 0.35)
  Top 0.152: C4.2 39.54,50.38 LMP2.OUT 39.69,49.21 v39.37,49.53 | v54.61,35.56 52.39,33.34 MOS2.GATE
  Bottom 0.152: v39.37,49.53 49.53,49.53 54.61,44.45 v54.61,35.56
N$11
  Top 0.152: R8.1 38.45,54.54 D2.NOT_USE 35.56,53.09 D2.- 39.3,52.14 41.91,49.53 41.91,48.51 LMP2.IN- 43.11,43.19 C3.- 46.6,40.64 MOS2.SOURCE | R12.2 68.16,55.88 57.15,55.88 55.88,54.61 55.88,48.68 R14.1 | C5.+ 63.53,40.67 | 63.53,40.67 59.69,44.51 R14.1 | R11.P$2 63.53,34.9 63.53,40.67 | R14.1 63.67,44.87 LMP3.IN+
  Top 3.353: C5.+ C3.-
N$12
  Top 0.152: R8.2 R7.1 42.33,52.92 43.18,52.07 43.18,49.28 LMP2.V+
N$13
  Top 0.152: LMP2.V- 37.25,48.26 C4.1 34.72,48.68 R10.2
N$14
  Top 0.152: D2.+ 34.61,51.97 R10.1 32.17,48.69 R9.2
N$15  (3 unrouted)
N$16
  Top 0.152: R11.P$1 MOS3.DRAIN
N$17  (via drill 0.35)
  Top 0.152: C6.2 64.94,50.38 LMP3.OUT 65.09,49.21 v64.77,49.53 | v80.01,35.56 77.79,33.34 MOS3.GATE
  Bottom 0.152: v64.77,49.53 74.93,49.53 80.01,44.45 v80.01,35.56
N$18
  Top 0.152: R13.1 61.03,54.61 D3.NOT_USE 60.96,53.09 D3.- 64.7,52.14 67.31,49.53 67.31,48.51 LMP3.IN- 68.51,43.19 C5.- 76.46,35.24 MOS3.SOURCE | R16.P$2 88.96,34.87 C7.+ 88.96,41 85.3,44.66 | 85.3,44.66 R19.1 81.28,48.68 81.28,53.34 83.82,55.88 93.56,55.88 R17.2 | LMP4.IN+ 88.86,44.66 85.3,44.66
  Top 3.353: C5.- C7.+
N$19
  Top 0.152: R13.2 R12.1 67.73,52.92 68.58,52.07 68.58,49.28 LMP3.V+
N$20
  Top 0.152: LMP3.V- 62.65,48.26 C6.1 60.12,48.68 R15.2
N$21
  Top 0.152: D3.+ 60.01,51.97 R15.1 57.57,48.69 R14.2
N$22  (1 unrouted)
N$23
  Top 0.152: R16.P$1 MOS4.DRAIN
N$24  (via drill 0.35)
  Top 0.152: MOS4.GATE 104.46,33.34 v105.41,34.29 | 91.44,49.28 LMP4.OUT 91.19,49.53 v90.17,49.53 89.32,50.38 C8.2
  Bottom 0.152: v105.41,34.29 105.41,35.56 104.14,36.83 104.14,43.18 97.79,49.53 v90.17,49.53
N$25
  Top 0.152: R18.1 89.25,54.54 D4.NOT_USE 87.31,53.59 D4.- 91.37,52.14 92.71,50.8 92.71,48.26 93.66,47.31 LMP4.IN- 96.46,44.76 C7.- 97.4,40.64 MOS4.SOURCE | R24.1 114.36,41 C9.+ 114.36,34.87 R21.P$2 | R24.1 114.47,44.87 LMP5.IN+ | R22.2 120.23,55.03 119.38,55.88 109.22,55.88 106.68,53.34 106.68,48.26 110.07,44.87 R24.1
  Top 3.353: C7.- C9.+
N$26
  Top 0.152: R18.2 R17.1 93.13,52.92 93.98,52.07 93.98,49.28 LMP4.V+
N$27
  Top 0.152: LMP4.V- 88.05,48.26 C8.1 85.52,48.68 R20.2
N$28
  Top 0.152: R19.2 82.97,48.69 R20.1 85.41,51.97 D4.+
N$29  (3 unrouted)
N$30
  Top 0.152: R21.P$1 MOS5.DRAIN
N$31  (via drill 0.35)
  Top 0.152: MOS5.GATE 129.86,33.34 v130.81,34.29 | LMP5.OUT 116.59,49.53 v115.57,49.53 114.72,50.38 C10.2
  Bottom 0.152: v130.81,34.29 130.81,35.56 129.54,36.83 129.54,43.18 123.19,49.53 v115.57,49.53
N$32
  Top 0.152: MOS5.SOURCE 122.8,40.64 C9.- 121.86,44.76 LMP5.IN- 119.06,47.31 118.11,48.26 118.11,50.8 116.77,52.14 D5.- 112.71,52.39 111.76,53.34 D5.NOT_USE 111.83,54.61 R23.1 | R26.P$2 121.86,26.09 C11.+ 121.86,19.96 125.52,16.3 | 125.52,16.3 R29.1 121.75,16.09 LMP6.IN+ | R27.2 116.84,5.5 116.84,5.08 127,5.08 129.54,7.62 129.54,12.7 125.94,16.3 125.52,16.3
  Top 3.353: C9.- 132.08,40.64 arc-90 134.62,38.1 134.62,22.86 arc-90 132.08,20.32 C11.+
N$33
  Top 0.152: R23.2 R22.1 118.53,52.92 119.38,52.07 119.38,49.28 LMP5.V+
N$34
  Top 0.152: R25.2 110.92,48.68 C10.1 113.45,48.26 LMP5.V-
N$35
  Top 0.152: R24.2 110.49,47.41 R25.1 108.37,49.7 D5.+
N$36  (3 unrouted)
N$37
  Top 0.152: MOS6.DRAIN R26.P$1
N$38  (via drill 0.35)
  Top 0.152: MOS6.GATE 106.36,27.62 v105.41,26.67 | LMP6.OUT 119.63,11.43 v120.65,11.43 121.5,10.58 C12.2
  Bottom 0.152: v105.41,26.67 105.41,25.4 106.68,24.13 106.68,17.78 113.03,11.43 v120.65,11.43
N$39
  Top 0.152: MOS6.SOURCE 113.42,20.32 114.3,20.32 | 114.3,20.32 C11.- | 114.3,20.32 114.3,16.26 LMP6.IN- 117.16,13.65 118.11,12.7 118.11,10.16 119.45,8.82 123.26,8.82 | D6.- 123.26,8.82 | R28.1 121.57,6.42 D6.NOT_USE 124.46,7.62 123.26,8.82 | R31.P$2 96.46,26.09 C13.+ 100.33,16.45 R34.1 | R34.1 96.35,16.09 LMP7.IN+ | R32.2 91.86,5.08 100.33,5.08 104.14,8.89 104.14,12.7 100.75,16.09 R34.1
  Top 3.353: C13.+ 114.3,20.32
N$40
  Top 0.152: R28.2 R27.1 117.69,8.04 116.84,8.89 116.84,11.68 LMP6.V+
N$41
  Top 0.152: R30.2 125.3,12.28 C12.1 122.77,12.7 LMP6.V-
N$42
  Top 0.152: R29.2 125.73,13.55 R30.1 127.85,11.26 D6.+
N$43  (3 unrouted)
N$44
  Top 0.152: MOS7.DRAIN R31.P$1
N$45  (via drill 0.35)
  Top 0.152: LMP7.OUT v95.08,10.58 C14.2 | v80.01,26.67 80.96,27.62 MOS7.GATE
  Bottom 0.152: v95.08,10.58 88.48,10.58 80.01,19.05 v80.01,26.67
N$46
  Top 0.152: R36.P$2 71.06,26.09 C15.+ 74.93,16.45 R39.1 | MOS7.SOURCE 88.02,20.32 C13.- 88.96,16.2 LMP7.IN- 92.71,12.45 92.71,10.16 94.05,8.82 D7.- 98.99,7.94 98.99,6.35 | D7.NOT_USE 98.99,6.35 | 98.99,6.35 R33.1 | R39.1 70.95,16.09 LMP8.IN+ | R37.2 66.46,5.08 74.93,5.08 78.74,8.89 78.74,12.7 75.35,16.09 R39.1
  Top 3.353: C15.+ C13.-
N$47
  Top 0.152: LMP7.V+ 91.44,11.68 91.44,10.16 92.29,9.31 R32.1 R33.2
N$48
  Top 0.152: R35.2 99.9,12.28 C14.1 97.37,12.7 LMP7.V-
N$49
  Top 0.152: R34.2 102.45,12.27 R35.1 100.01,8.99 D7.+
N$50  (1 unrouted)
N$51
  Top 0.152: MOS8.DRAIN R36.P$1
N$52  (via drill 0.35)
  Top 0.152: LMP8.OUT v69.68,10.58 C16.2 | v54.61,26.67 55.56,27.62 MOS8.GATE
  Bottom 0.152: v69.68,10.58 63.08,10.58 54.61,19.05 v54.61,26.67
N$53
  Top 0.152: R41.P$2 45.66,26.09 C17.+ 49.53,16.45 R44.1 | MOS8.SOURCE 62.62,20.32 63.5,20.32 C15.- 63.56,16.2 LMP8.IN- 67.31,12.45 67.31,10.16 68.65,8.82 D8.- 73.62,7.91 73.62,6.38 | D8.NOT_USE 73.62,6.38 | 73.62,6.38 73.59,6.35 R38.1 | R44.1 45.55,16.09 LMP9.IN+ | R44.1 49.95,16.09 53.34,12.7 53.34,6.35 52.07,5.08 41.06,5.08 R42.2
  Top 3.353: C17.+ 63.5,20.32
N$54
  Top 0.152: LMP8.V+ 66.04,11.68 66.04,10.16 66.89,9.31 R37.1 R38.2
N$55
  Top 0.152: R40.2 74.5,12.28 C16.1 71.97,12.7 LMP8.V-
N$56
  Top 0.152: R39.2 77.05,12.27 R40.1 74.61,8.99 D8.+
N$57  (3 unrouted)
N$58
  Top 0.152: MOS9.DRAIN R41.P$1
N$59  (via drill 0.35)
  Top 0.152: LMP9.OUT 44.28,10.58 v44.45,10.58 C18.2 | v29.21,26.67 30.16,27.62 MOS9.GATE
  Bottom 0.152: v44.45,10.58 37.68,10.58 29.21,19.05 v29.21,26.67
N$60  (3 unrouted)
N$61
  Top 0.152: LMP9.V+ 40.64,11.68 40.64,10.16 41.49,9.31 R42.1 R43.2
N$62
  Top 0.152: R45.2 49.1,12.28 C18.1 46.57,12.7 LMP9.V-
N$63
  Top 0.152: R44.2 51.65,12.27 R45.1 51.65,11.26 D9.+
N$64  (3 unrouted)
N$65  (1 unrouted)
N$66  (1 unrouted)
N$67  (1 unrouted)
N$68  (2 unrouted)
N$69  (1 unrouted)
N$70  (3 unrouted)
N$71  (3 unrouted)
N$72  (3 unrouted)
N$73  (2 unrouted)
N$74  (1 unrouted)
N$75  (1 unrouted)
N$76  (2 unrouted)
N$77  (1 unrouted)
VIN  (1 unrouted)
  Top 0.152: C1.+ 12.73,40.67 | 12.73,40.67 12.7,40.7 | LMP1.IN+ 12.87,44.87 R4.1 | R4.1 9.1,44.66 | 9.1,44.66 12.73,41.03 12.73,40.67 | R1.P$2 12.73,34.9 12.73,40.67 | 8.68,44.66 9.1,44.66 | R2.2 17.36,55.88 6.35,55.88 5.08,54.61 5.08,48.68 R4.1
  Top 3.353: C1.+ 13.39,40.01 PWR_IN.+ PWR_OUT.+